# Altium schematic sheet Volant5.LEDdriver.SchDoc
size A4
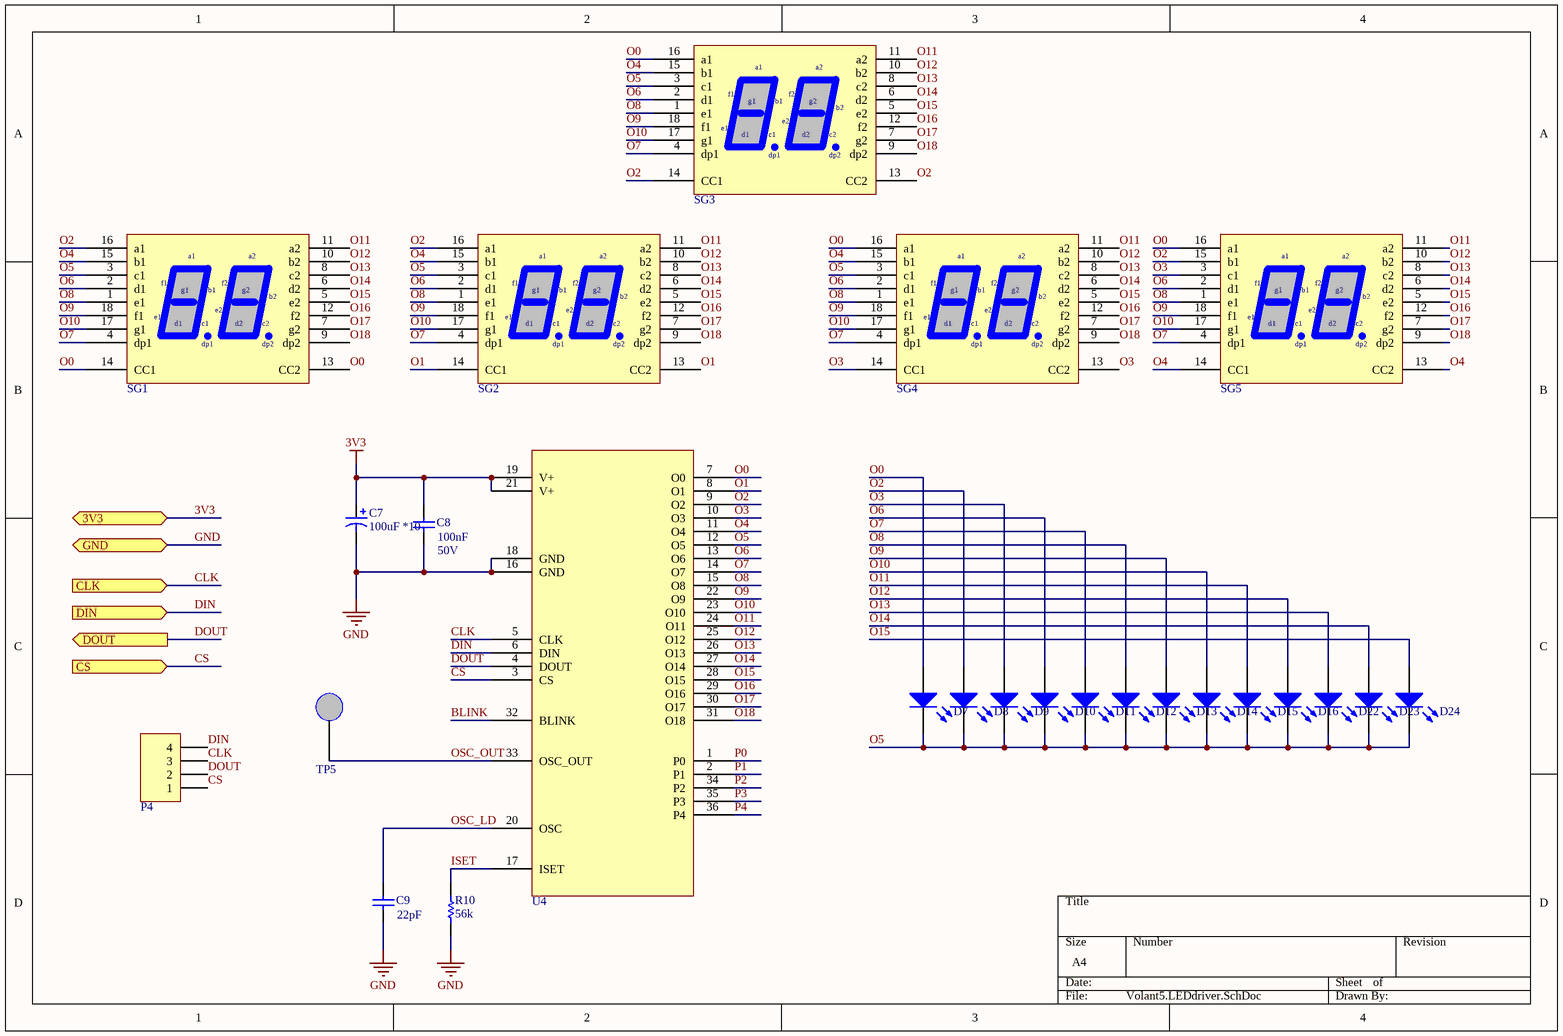
[diagram p0: Volant5.LEDdriver.SchDoc]

## Parts
C7  value 100uF *10  [CS-POL-6.3X4.2]  (hidden comment: CS - CAPACITOR ELECTROLYTIC)
C8  value 100nF  VOLTAGE: 50V  [CS-0603]  (hidden comment: CS - CAPACITOR)
C9  value 22pF  [CS-0603]  (hidden comment: CS - CAPACITOR)
D7  LED - NORMAL LED  [LED-1206 BLUE]  (value not drawn)
D8  LED - NORMAL LED  [LED-1206 BLUE]  (value not drawn)
D9  LED - NORMAL LED  [LED-1206 BLUE]  (value not drawn)
D10  LED - NORMAL LED  [LED-1206 BLUE]  (value not drawn)
D11  LED - NORMAL LED  [LED-1206 BLUE]  (value not drawn)
D12  LED - NORMAL LED  [LED-1206 BLUE]  (value not drawn)
D13  LED - NORMAL LED  [LED-1206 BLUE]  (value not drawn)
D14  LED - NORMAL LED  [LED-1206 BLUE]  (value not drawn)
D15  LED - NORMAL LED  [LED-1206 BLUE]  (value not drawn)
D16  LED - NORMAL LED  [LED-1206 BLUE]  (value not drawn)
D22  LED - NORMAL LED  [LED-1206 BLUE]  (value not drawn)
D23  LED - NORMAL LED  [LED-1206 BLUE]  (value not drawn)
D24  LED - NORMAL LED  [LED-1206 BLUE]  (value not drawn)
P4  CON - HEADER 1X4  [CON-HEADER-1X4]  (value not drawn)
R10  value 56k  [RS-0603]  (hidden comment: RS - RESISTOR)
SG1  LB-602VK2  [DISP-DUAL 7SEG 18 pin]  (value not drawn)
SG2  LB-602VK2  [DISP-DUAL 7SEG 18 pin]  (value not drawn)
SG3  LB-602VK2  [DISP-DUAL 7SEG 18 pin]  (value not drawn)
SG4  LB-602VK2  [DISP-DUAL 7SEG 18 pin]  (value not drawn)
SG5  LB-602VK2  [DISP-DUAL 7SEG 18 pin]  (value not drawn)
TP5  OSC LED  [TP - VERTICAL]  (value not drawn)
U4  MAX6954AAX  [IC-SSOP-36]  (value not drawn)

## Ports
3V3, CLK (in), CS (in), DIN (in), DOUT (out), GND

## Nets
3V3: C7.1 C8.2 U4.19(V+) U4.21(V+) ; port 3V3
GND: C7.2 C8.1 C9.1 R10.1 U4.16(GND) U4.18(GND) ; port GND
BLINK: U4.32(BLINK)
CLK: P4.3 U4.5(CLK) ; port CLK
CS: P4.1 U4.3(CS) ; port CS
DIN: P4.4 U4.6(DIN) ; port DIN
DOUT: P4.2 U4.4(DOUT) ; port DOUT
ISET: R10.2 U4.17(ISET)
O0: D7.A SG1.13(CC2) SG1.14(CC1) SG3.16(a1) SG4.16(a1) SG5.16(a1) U4.7(O0)
O1: SG2.13(CC2) SG2.14(CC1) U4.8(O1)
O2: D8.A SG1.16(a1) SG2.16(a1) SG3.13(CC2) SG3.14(CC1) SG5.15(b1) U4.9(O2)
O3: D9.A SG4.13(CC2) SG4.14(CC1) SG5.3(c1) U4.10(O3)
O4: SG1.15(b1) SG2.15(b1) SG3.15(b1) SG4.15(b1) SG5.13(CC2) SG5.14(CC1) U4.11(O4)
O5: D7.K D8.K D9.K D10.K D11.K D12.K D13.K D14.K D15.K D16.K D22.K D23.K D24.K SG1.3(c1) SG2.3(c1) SG3.3(c1) SG4.3(c1) U4.12(O5)
O6: D10.A SG1.2(d1) SG2.2(d1) SG3.2(d1) SG4.2(d1) SG5.2(d1) U4.13(O6)
O7: D11.A SG1.4(dp1) SG2.4(dp1) SG3.4(dp1) SG4.4(dp1) SG5.4(dp1) U4.14(O7)
O8: D12.A SG1.1(e1) SG2.1(e1) SG3.1(e1) SG4.1(e1) SG5.1(e1) U4.15(O8)
O9: D13.A SG1.18(f1) SG2.18(f1) SG3.18(f1) SG4.18(f1) SG5.18(f1) U4.22(O9)
O10: D14.A SG1.17(g1) SG2.17(g1) SG3.17(g1) SG4.17(g1) SG5.17(g1) U4.23(O10)
O11: D15.A SG1.11(a2) SG2.11(a2) SG3.11(a2) SG4.11(a2) SG5.11(a2) U4.24(O11)
O12: D16.A SG1.10(b2) SG2.10(b2) SG3.10(b2) SG4.10(b2) SG5.10(b2) U4.25(O12)
O13: D22.A SG1.8(c2) SG2.8(c2) SG3.8(c2) SG4.8(c2) SG5.8(c2) U4.26(O13)
O14: D23.A SG1.6(d2) SG2.6(d2) SG3.6(d2) SG4.6(d2) SG5.6(d2) U4.27(O14)
O15: D24.A SG1.5(e2) SG2.5(e2) SG3.5(e2) SG4.5(e2) SG5.5(e2) U4.28(O15)
O16: SG1.12(f2) SG2.12(f2) SG3.12(f2) SG4.12(f2) SG5.12(f2) U4.29(O16)
O17: SG1.7(g2) SG2.7(g2) SG3.7(g2) SG4.7(g2) SG5.7(g2) U4.30(O17)
O18: SG1.9(dp2) SG2.9(dp2) SG3.9(dp2) SG4.9(dp2) SG5.9(dp2) U4.31(O18)
OSC_LD: C9.2 U4.20(OSC)
OSC_OUT: TP5.1 U4.33(OSC_OUT)
P0: U4.1(P0)
P1: U4.2(P1)
P2: U4.34(P2)
P3: U4.35(P3)
P4: U4.36(P4)

## Library data of the parts
C7 = CS - CAPACITOR ELECTROLYTIC: TOLERANCE: 10%; Supplier 1: *; Supplier Part Number 1: 493-2096-1-ND; (FIELD A): *; (FLIED C): *; (FIELD B): *; Manufacturer: *; VOLTAGE: VOLTAGE
C8 C9 = CS - CAPACITOR: TOLERANCE: 10%; Supplier 1: *; (FIELD A): *; (FLIED C): *; (FIELD B): *; Manufacturer: *
  C8: Supplier Part Number 1: 490-1532-1-ND
  C9: Supplier Part Number 1: 399-9031-1-ND
D7-D16 D22-D24 = LED - NORMAL LED: FORWARS VOLTAGE: 1,75V; CURRENT: 20mA; COLOR: RED; Supplier Part Number 1: 511-1286-2-ND; Supplier 1: Digi-Key; (FIELD B): *; (FIELD A): *; (FIELD C): *; Manufacturer: *
P4 = CON - HEADER 1X4: 100mil header 1 row 4pins; Manufacturer: *; (FIELD A): *; (FIELD B): *; (FIELD C): *; Supplier 1: Digi-Key; Supplier Part Number 1: S1011EC-04-ND
R10 = RS - RESISTOR: TOLERANCE: RES TOL; POWER: RES POWER; Supplier Part Number 1: *; Supplier 1: *; (FIELD A): *; (FLIED C): *; (FIELD B): *; Manufacturer: *
SG1-SG5 = DISP - LB-602VK2: DUAL 7 SEG DISP HIGH BRIGHTNESS; Manufacturer: ROHM; (FIELD A): RED; (FIELD B): 14.3 mm high; (FIELD C): Cathode Commune; Supplier 1: Digi-Key; Supplier Part Number 1: 511-1562-ND
TP5 = TP - Test point vertical: (FIELD A): *; (FIELD B): *; (FIELD C): *; Manufacturer: *; Supplier 1: Newark; Supplier Part Number 1: 62W5140
U4 = IC - MAX6954: DRIVE 8 DIGIT 7SEG; Manufacturer: Maxim Integrated; Supplier 1: Digi-Key; Supplier Part Number 1: MAX6954AAX+-ND; (FIELD A): *; (FIELD B): *; (FIELD C): *